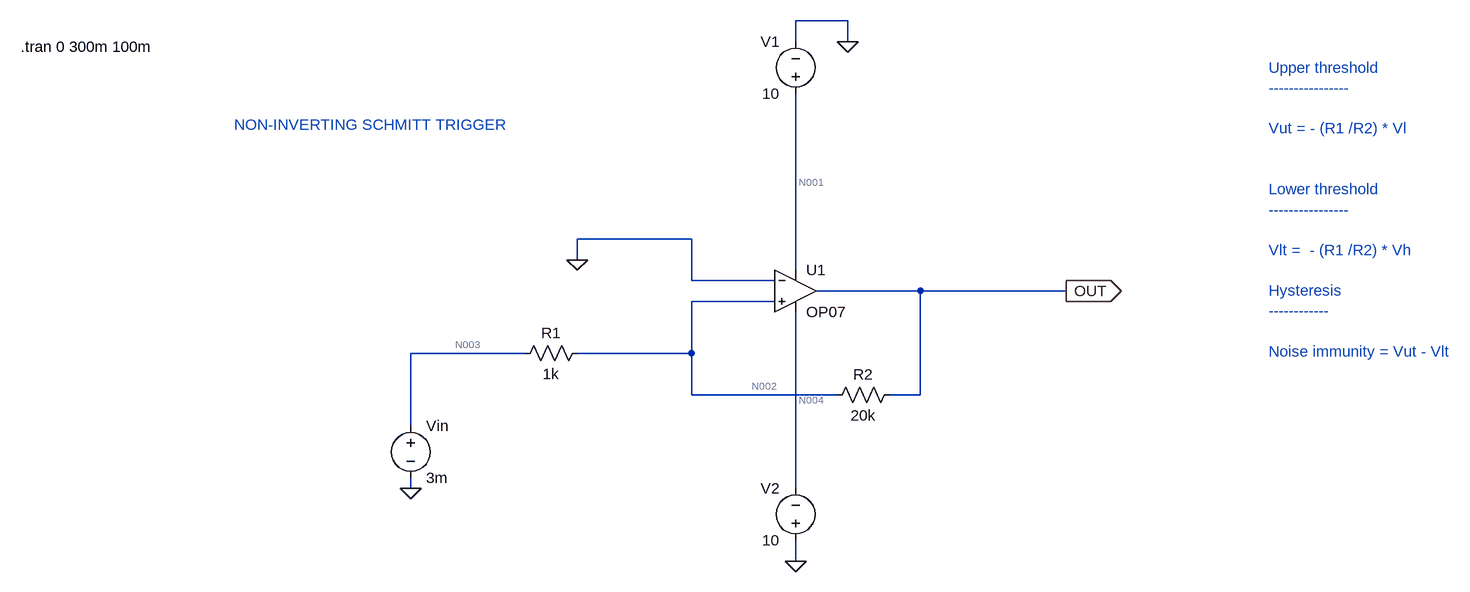
[diagram p0: schematic opAmp_as_NON_inverting_schmitt_trigger.asc]
opAmp_as_NON_inverting_schmitt_trigger.asc, the LTspice schematic file:
Version 4.1
SHEET 1 1320 680
WIRE 336 -240 256 -240
WIRE 256 -208 256 -240
WIRE 336 -208 336 -240
WIRE 96 96 -80 96
WIRE -80 128 -80 96
WIRE 256 144 256 -128
WIRE 96 160 96 96
WIRE 224 160 96 160
WIRE 448 176 288 176
WIRE 672 176 448 176
WIRE 224 192 96 192
WIRE -160 272 -336 272
WIRE 96 272 96 192
WIRE 96 272 -80 272
WIRE 96 336 96 272
WIRE 320 336 96 336
WIRE 448 336 448 176
WIRE 448 336 400 336
WIRE -336 384 -336 272
WIRE -336 480 -336 464
WIRE 256 480 256 208
WIRE 256 592 256 560
FLAG 336 -208 0
FLAG 256 592 0
FLAG -80 128 0
FLAG -336 480 0
FLAG 672 176 OUT
IOPIN 672 176 Out
SYMBOL OpAmps\\OP07 256 112 R0
SYMATTR InstName U1
SYMBOL voltage 256 -112 R180
WINDOW 0 24 96 Left 2
WINDOW 3 24 16 Left 2
WINDOW 123 0 0 Left 0
WINDOW 39 0 0 Left 0
SYMATTR InstName V1
SYMATTR Value 10
SYMBOL voltage 256 576 R180
WINDOW 0 24 96 Left 2
WINDOW 3 24 16 Left 2
WINDOW 123 0 0 Left 0
WINDOW 39 0 0 Left 0
SYMATTR InstName V2
SYMATTR Value 10
SYMBOL voltage -336 368 R0
WINDOW 123 0 0 Left 0
WINDOW 39 0 0 Left 0
SYMATTR InstName Vin
SYMATTR Value 3m
SYMBOL res 416 320 R90
WINDOW 0 0 56 VBottom 2
WINDOW 3 32 56 VTop 2
SYMATTR InstName R2
SYMATTR Value 20k
SYMBOL res -64 256 R90
WINDOW 0 0 56 VBottom 2
WINDOW 3 32 56 VTop 2
SYMATTR InstName R1
SYMATTR Value 1k
TEXT -936 -200 Left 2 !.tran 0 300m 100m
TEXT 984 -168 Left 2 ;Upper threshold\n----------------\n \nVut = - (R1 /R2) * Vl\n \n \nLower threshold\n----------------\n \nVlt =  - (R1 /R2) * Vh\n \nHysteresis\n------------\n \nNoise immunity = Vut - Vlt
TEXT -608 -80 Left 2 ;NON-INVERTING SCHMITT TRIGGER

The netlist it stands for:
* opAmp_as_NON_inverting_schmitt_trigger.asc
X§U1 N002 0 N001 N004 OUT LT1001  ; OP07, pins In+ In- V+ V- OUT
V1 N001 0 10
V2 0 N004 10
Vin N003 0 3m
R2 OUT N002 20k
R1 N002 N003 1k
.tran 0 300m 100m
* Upper threshold
* ----------------
* Vut = - (R1 /R2) * Vl
* Lower threshold
* ----------------
* Vlt =  - (R1 /R2) * Vh
* Hysteresis
* ------------
* Noise immunity = Vut - Vlt
* NON-INVERTING SCHMITT TRIGGER
.lib LTC.lib
.backanno
.end

* Results of the author's LTspice run, read from the files saved beside the schematic
* Operating Point, zero values left out:
*   V(n001) = 10 V
*   V(out) = 9.055 V
*   V(n003) = 3 mV
*   V(n002) = 434.1 mV
*   V(n004) = -10 V
*   I(V1) = -2.467 mA
*   I(R2) = 431.1 µA
*   I(V2) = -2.043 mA
*   I(Vin) = 431.1 µA
*   I(R1) = 431.1 µA
*   Ix(u1:1) = 5.86 nA
*   Ix(u1:2) = -5.86 nA
*   Ix(u1:3) = 2.467 mA
*   Ix(u1:4) = -2.043 mA
*   Ix(u1:5) = -431.1 µA